# EAGLE design level_shifter_adj_15V (EAGLE 9.5.1)
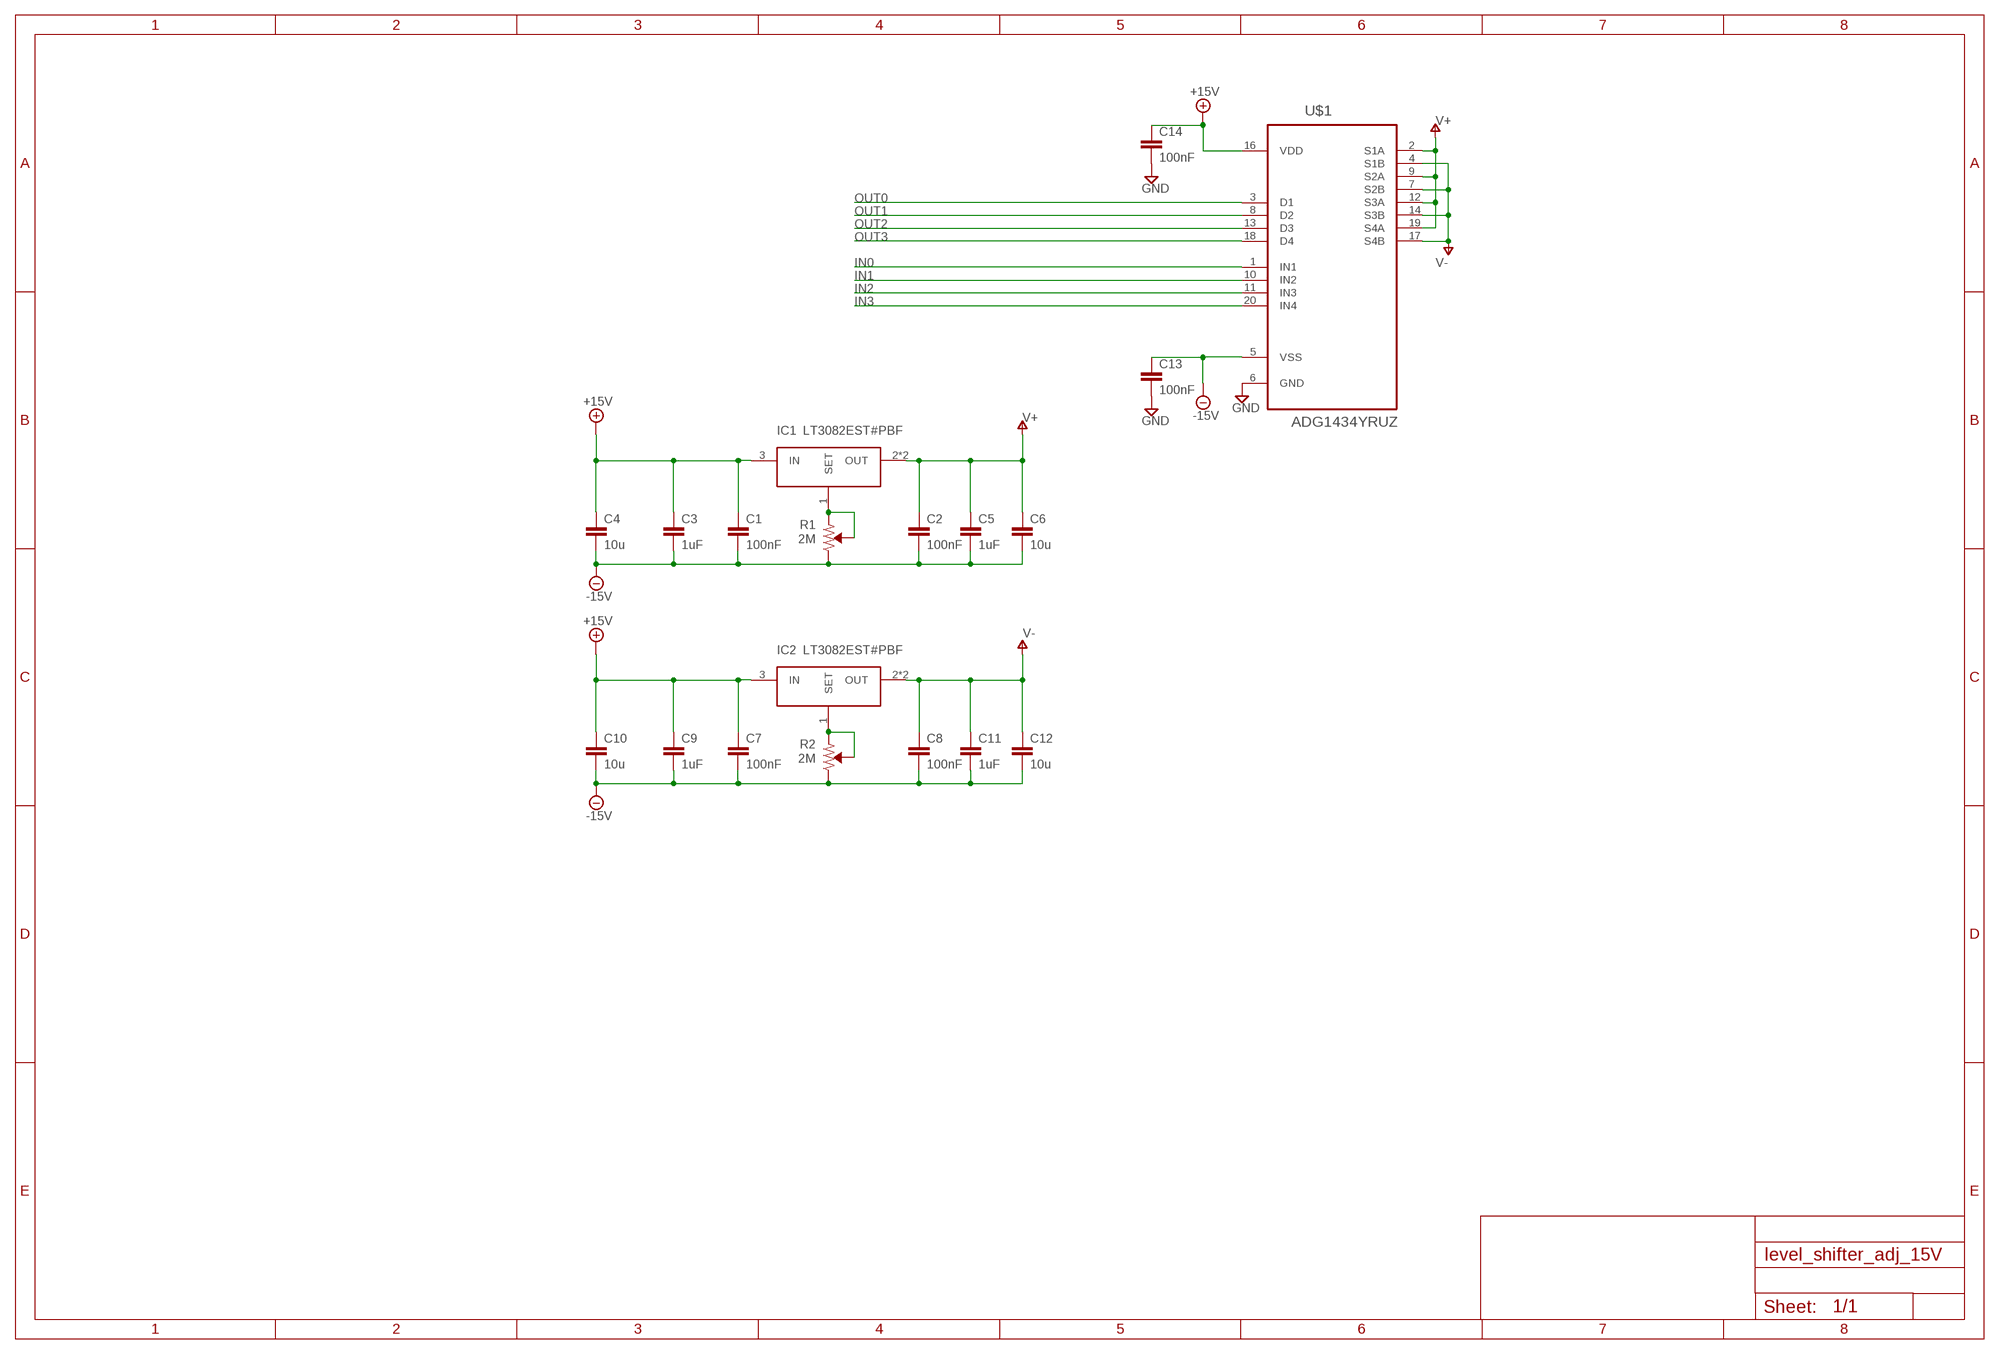
[diagram p0: schematic, sheet 1]

## Parts
C1  100nF  C-EUC0402  [C0402]
C2  100nF  C-EUC0402  [C0402]
C3  1uF  C-EUC0402  [C0402]
C4  10u  C-EUC0603  [C0603]
C5  1uF  C-EUC0402  [C0402]
C6  10u  C-EUC0603  [C0603]
C7  100nF  C-EUC0402  [C0402]
C8  100nF  C-EUC0402  [C0402]
C9  1uF  C-EUC0402  [C0402]
C10  10u  C-EUC0603  [C0603]
C11  1uF  C-EUC0402  [C0402]
C12  10u  C-EUC0603  [C0603]
C13  100nF  C-EUC0402  [C0402]
C14  100nF  C-EUC0402  [C0402]
IC1  LT3082EST#PBF  [SOT230P700X180-4N]
IC2  LT3082EST#PBF  [SOT230P700X180-4N]
R1  2M  3296Y-1  [TRIM_3296Y-1-202LF]
R2  2M  3296Y-1  [TRIM_3296Y-1-202LF]
U$1  ADG1434YRUZ  [SOP65P640X120-20N]

## Nets
+15V: C1.1 C3.1 C4.1 C7.1 C9.1 C10.1 C14.1 IC1.3(IN) IC2.3(IN) U$1.16(VDD)
-15V: C1.2 C2.2 C3.2 C4.2 C5.2 C6.2 C7.2 C8.2 C9.2 C10.2 C11.2 C12.2 C13.1 R1.3(CW) R2.3(CW) U$1.5(VSS)
GND: C13.2 C14.2 U$1.6(GND)
IN0: U$1.1(IN1)
IN1: U$1.10(IN2)
IN2: U$1.11(IN3)
IN3: U$1.20(IN4)
N$1: IC2.1(SET) R2.1(CCW) R2.2(WIPER)
N$3: IC1.1(SET) R1.1(CCW) R1.2(WIPER)
OUT0: U$1.3(D1)
OUT1: U$1.8(D2)
OUT2: U$1.13(D3)
OUT3: U$1.18(D4)
V+: C2.1 C5.1 C6.1 IC1.2(OUT) IC1.4(OUT) U$1.2(S1A) U$1.9(S2A) U$1.12(S3A) U$1.19(S4A)
V-: C8.1 C11.1 C12.1 IC2.2(OUT) IC2.4(OUT) U$1.4(S1B) U$1.7(S2B) U$1.14(S3B) U$1.17(S4B)

## Library data of the parts
C1 C2 C7 C8 C13 C14 = resistor:C-EU: CAPACITOR, European symbol
C3-C6 C9-C12 = resistor:C-EU: CAPACITOR, European symbol; VOLTAGERATING: 25V
IC1 IC2 = wouter:LT3082EST#PBF: LINEAR TECHNOLOGY - LT3082EST#PBF - LDO, ADJ, 1.3VDO, 0.2A, 3SOT223 Source: Datasheet <http://www.analog.com/media/en/technical-documentation/data-sheets/3082f.pdf>; DESCRIPTION: LINEAR TECHNOLOGY - LT3082EST#PBF - LDO, ADJ, 1.3VDO, 0.2A, 3SOT223; HEIGHT: 1.8mm; MANUFACTURER_NAME: Linear Technology; MANUFACTURER_PART_NUMBER: LT3082EST#PBF; MOUSER_PART_NUMBER: 584-LT3082EST#PBF; MOUSER_PRICE-STOCK: https://www.mouser.com/Search/Refine.aspx?Keyword=584-LT3082EST%23PBF
R1 R2 = output:3296Y-1: BOURNS - 3296Y-1 - Trimmer Potentiometer, 25 Turns, Through Hole, Trimpot 3296 Series, 500 mW, ± 10%; DESCRIPTION: BOURNS - 3296Y-1 - Trimmer Potentiometer, 25 Turns, Through Hole, Trimpot 3296 Series, 500 mW, ± 10%
U$1 = output:ADG1434YRUZ

## Board
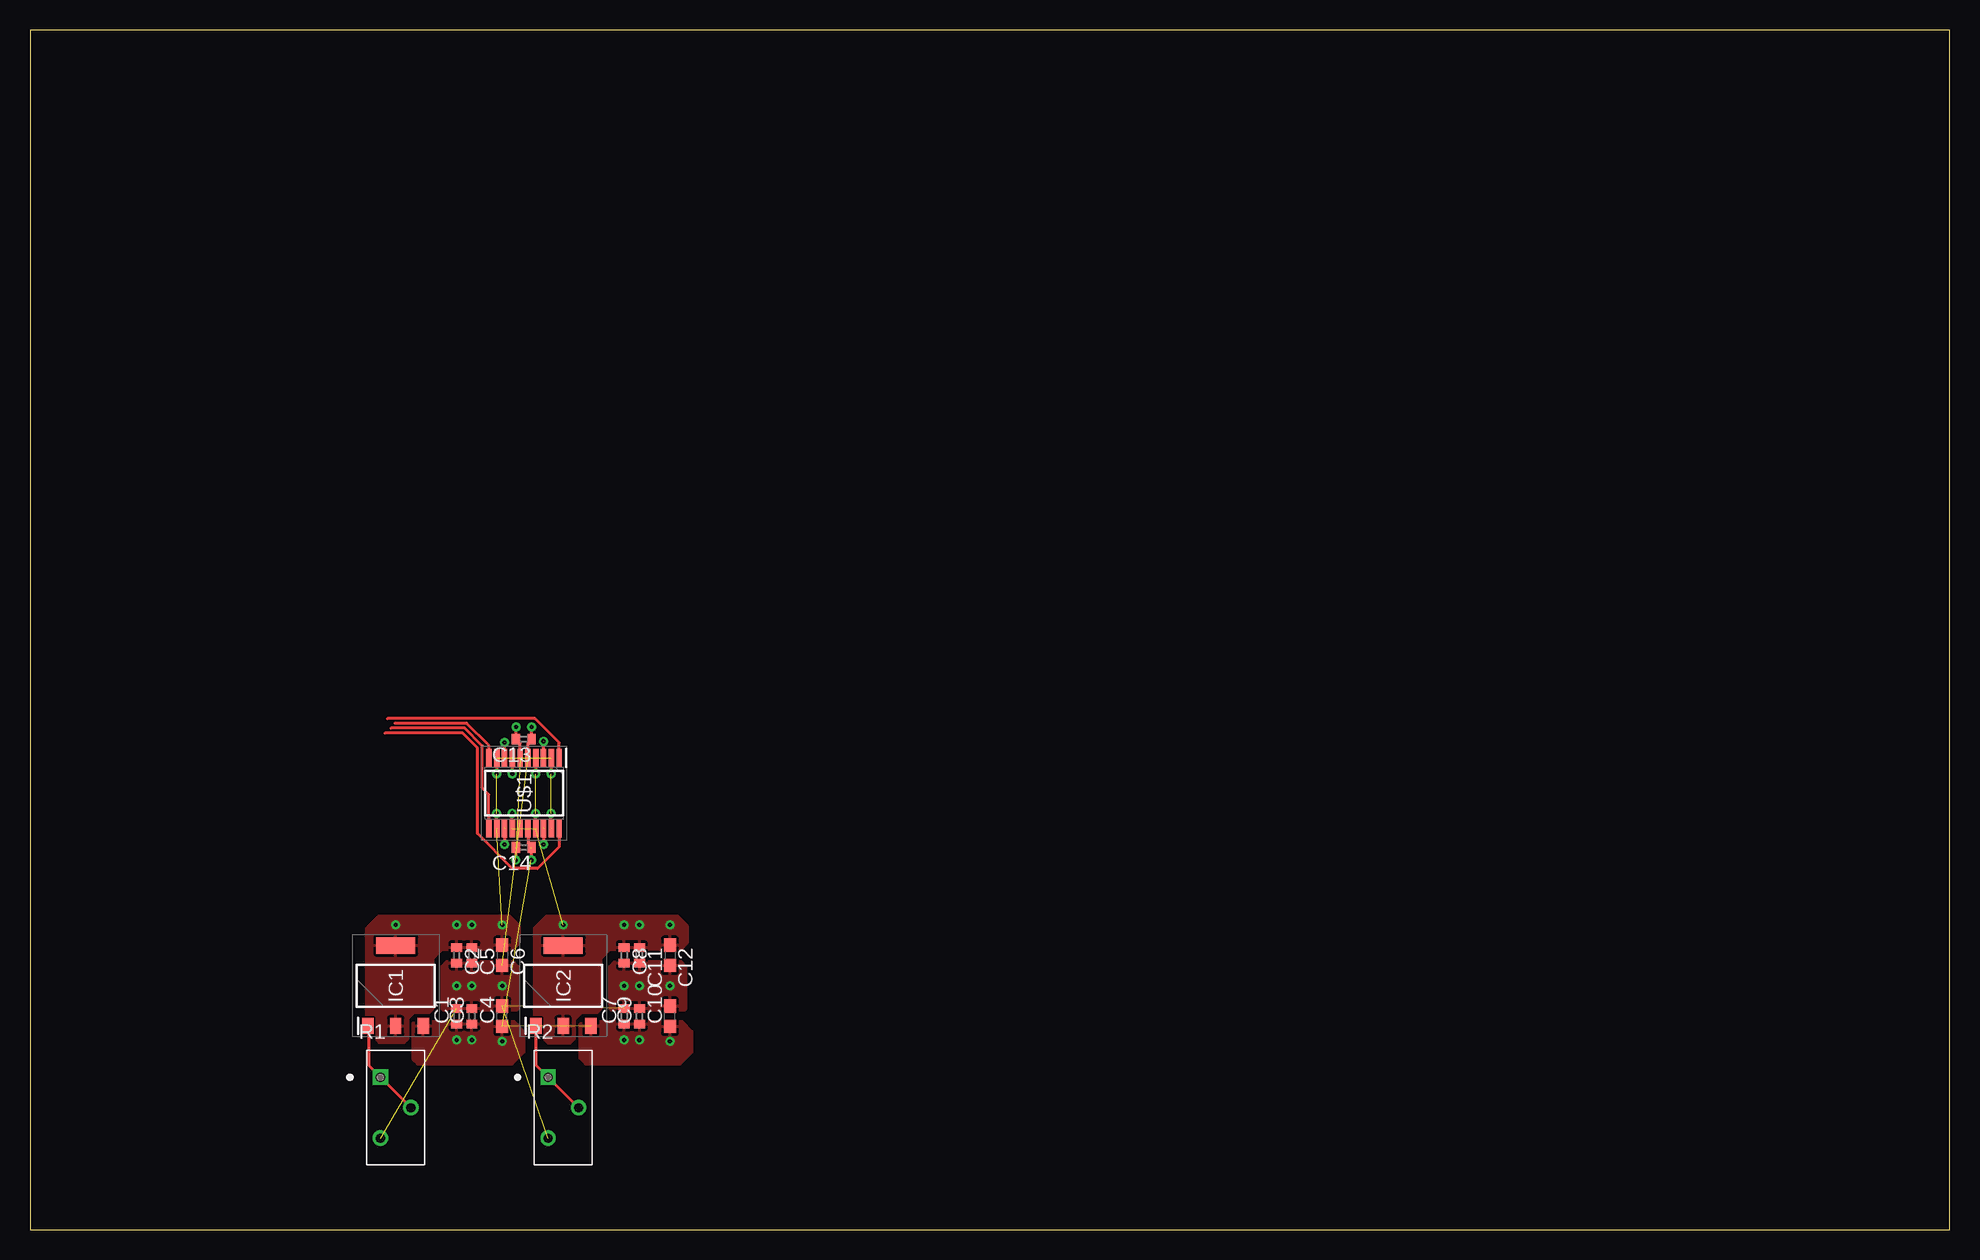
[diagram p1: board, top side]

Size 160 x 100 mm. Coordinates in mm from the lower left corner, seen from the top.
Outline: 0,0 160,0 160,100 0,100 0,0
Copper layers (1*16): Top 0.035mm / dielectric 1.5mm / Bottom 0.035mm
Design rules "default": minimum track width 6mil, minimum drill 0.35mm, track to track 6mil, track to pad 6mil, pad to pad 6mil, via to via 6mil, smd to smd 6mil, copper to edge 40mil, drill to drill 6mil, minimum pad ring 10mil, minimum via ring 8mil, stop-mask expansion 4mil, vias tented up to drill 0mil, thermal gap 10mil

### Footprints (pad centres in the part's own frame; a part is rotated, then mirrored left to right if it is on the bottom)
C0402 = smd 0.7 x 0.9: 1 -0.65,0; 2 0.65,0
C0603 = smd 1.1 x 1: 1 -0.85,0; 2 0.85,0
SOT230P700X180-4N = smd 1.35 x 0.95: 1 -3.35,2.3; 2 -3.35,0; 3 -3.35,-2.3 | smd 1.35 x 3.25: 4 3.35,0
TRIM_3296Y-1-202LF = drill 0.76 square: 1 -1.27,2.54 | drill 0.76: 2 1.27,0; 3 -1.27,-2.54
SOP65P640X120-20N = smd 1.475 x 0.45: 1 -2.938,2.925; 2 -2.938,2.275; 3 -2.938,1.625; 4 -2.938,0.975; 5 -2.938,0.325; 6 -2.938,-0.325; 7 -2.938,-0.975; 8 -2.938,-1.625; 9 -2.938,-2.275; 10 -2.938,-2.925; 11 2.938,-2.925; 12 2.938,-2.275; 13 2.938,-1.625; 14 2.938,-0.975; 15 2.938,-0.325; 16 2.938,0.325; 17 2.938,0.975; 18 2.938,1.625; 19 2.938,2.275; 20 2.938,2.925

### Placement (x,y rotation side)
C1  35.56,17.78 90 top
C2  35.56,22.86 270 top
C3  36.83,17.78 90 top
C4  39.37,17.78 90 top
C5  36.83,22.86 270 top
C6  39.37,22.86 270 top
C7  49.53,17.78 90 top
C8  49.53,22.86 270 top
C9  50.8,17.78 90 top
C10  53.34,17.78 90 top
C11  50.8,22.86 270 top
C12  53.34,22.86 270 top
C13  41.16,40.87 180 top
C14  41.16,31.85 180 top
IC1  30.48,20.32 90 top
IC2  44.45,20.32 90 top
R1  30.48,10.16 0 top
R2  44.45,10.16 0 top
U$1  41.18,36.38 270 top

### Tracks (layer width: path | path; a pad name or v marks a point on that pad's centre or on a via)
+15V  (via drill 0.35)  (3 unrouted)
  Top 0.25: U$1.16 41.51,32.16 C14.1 | 41.79,31.83 v41.79,30.8
  other vias: 35.56,15.8 36.83,15.8 39.37,15.7 49.53,15.8 50.8,15.8 53.34,15.7
  pour Top: 40.4,17.3 32,17.3 31.9,17.2 31.9,14.2 32.3,13.8 40.2,13.8 41.2,14.8 41.2,16.5
  pour Top: 54.4,17.3 46,17.3 45.8,17.1 45.8,14.3 46.3,13.8 54.2,13.8 55.2,14.8 55.2,16.5
-15V  (via drill 0.35)  (4 unrouted)
  Top 0.25: U$1.5 41.51,40.56 C13.1 v41.81,41.9
  other vias: 39.37,20.32 36.83,20.32 35.56,20.32 49.53,20.32 50.8,20.32 53.34,20.32
  pour Top: 34.7,22.3 34.3,21.9 34.3,18.4 34.4,18.3 40.6,18.3 40.7,18.4 40.7,21.9 40.3,22.3
  pour Top: 48.7,22.3 48.3,21.9 48.3,18.4 48.4,18.3 54.6,18.3 54.7,18.4 54.7,21.9 54.3,22.3
GND  (via drill 0.35)  (2 unrouted)
  Top 0.25: U$1.6 40.85,40.52 C13.2 v40.51,41.9 | 40.49,31.83 v40.49,30.8
IN0
  Top 0.25: U$1.1 44.1,40.59 42.1,42.6 29.8,42.6
IN1
  Top 0.25: U$1.10 38.26,40.34 36.4,42.2 30.4,42.2
IN2
  Top 0.25: U$1.11 38.26,34.41 38.24,34.43 38.24,36.26 37.7,36.8 37.7,40.33 36.24,41.8 30.1,41.8
IN3
  Top 0.25: U$1.20 44.1,31.91 42.3,30.1 40.2,30.1 37.3,33 37.3,40.16 36.07,41.39 29.6,41.39
N$1
  Top 0.25: IC2.1 42.15,13.73 R2.1 R2.2
N$3
  Top 0.25: IC1.1 28.21,16.94 28.21,13.7 R1.1 R1.2
OUT0  (via drill 0.35)  (1 unrouted)
  Top 0.25: U$1.3 v42.8,40.7
OUT1  (via drill 0.35)  (2 unrouted)
  Top 0.25: 39.55,39.22 v39.55,40.59
OUT2  (via drill 0.35)  (2 unrouted)
  Top 0.25: 39.55,33.48 v39.55,32.1
OUT3  (via drill 0.35)  (2 unrouted)
  Top 0.25: 42.8,33.48 v42.8,32.1
V+  (via drill 0.35)  (6 unrouted)
  Top 0.25: U$1.2 v43.45,38 | U$1.9 v38.91,38 | 38.9,33.38 v38.9,34.7 | 43.45,33.38 v43.45,34.7
  other vias: 30.48,25.4 35.56,25.4 36.83,25.4 39.37,25.4
  pour Top: 28,25.1 28,16.7 28.9,16.7 28.9,15.8 29.1,15.6 31.2,15.6 31.5,15.9 31.5,17.6 32,18.1 33.3,18.1 33.6,18.4 33.6,22.6 34.3,23.3 40.3,23.4 40.8,23.9 40.8,25.3 40,26.1 29,26.1
V-  (via drill 0.35)  (6 unrouted)
  Top 0.25: U$1.4 v42.16,38 | U$1.7 v40.2,38 | 40.2,33.38 v40.2,34.7 | 42.15,33.38 v42.15,34.7
  other vias: 44.45,25.4 49.53,25.4 50.8,25.4 53.34,25.4
  pour Top: 42,25.1 42,16.7 42.9,16.7 42.9,15.8 43.15,15.55 45.05,15.55 45.4,15.9 45.4,17.5 46,18.1 47.3,18.1 47.6,18.4 47.6,22.6 48.3,23.3 54.3,23.4 54.8,23.9 54.8,25.3 54,26.1 43,26.1